# EAGLE schematic ModuleCarrier-RAK811-v1.0.0 (EAGLE 7.7.0)

## Sheet 1 of 2
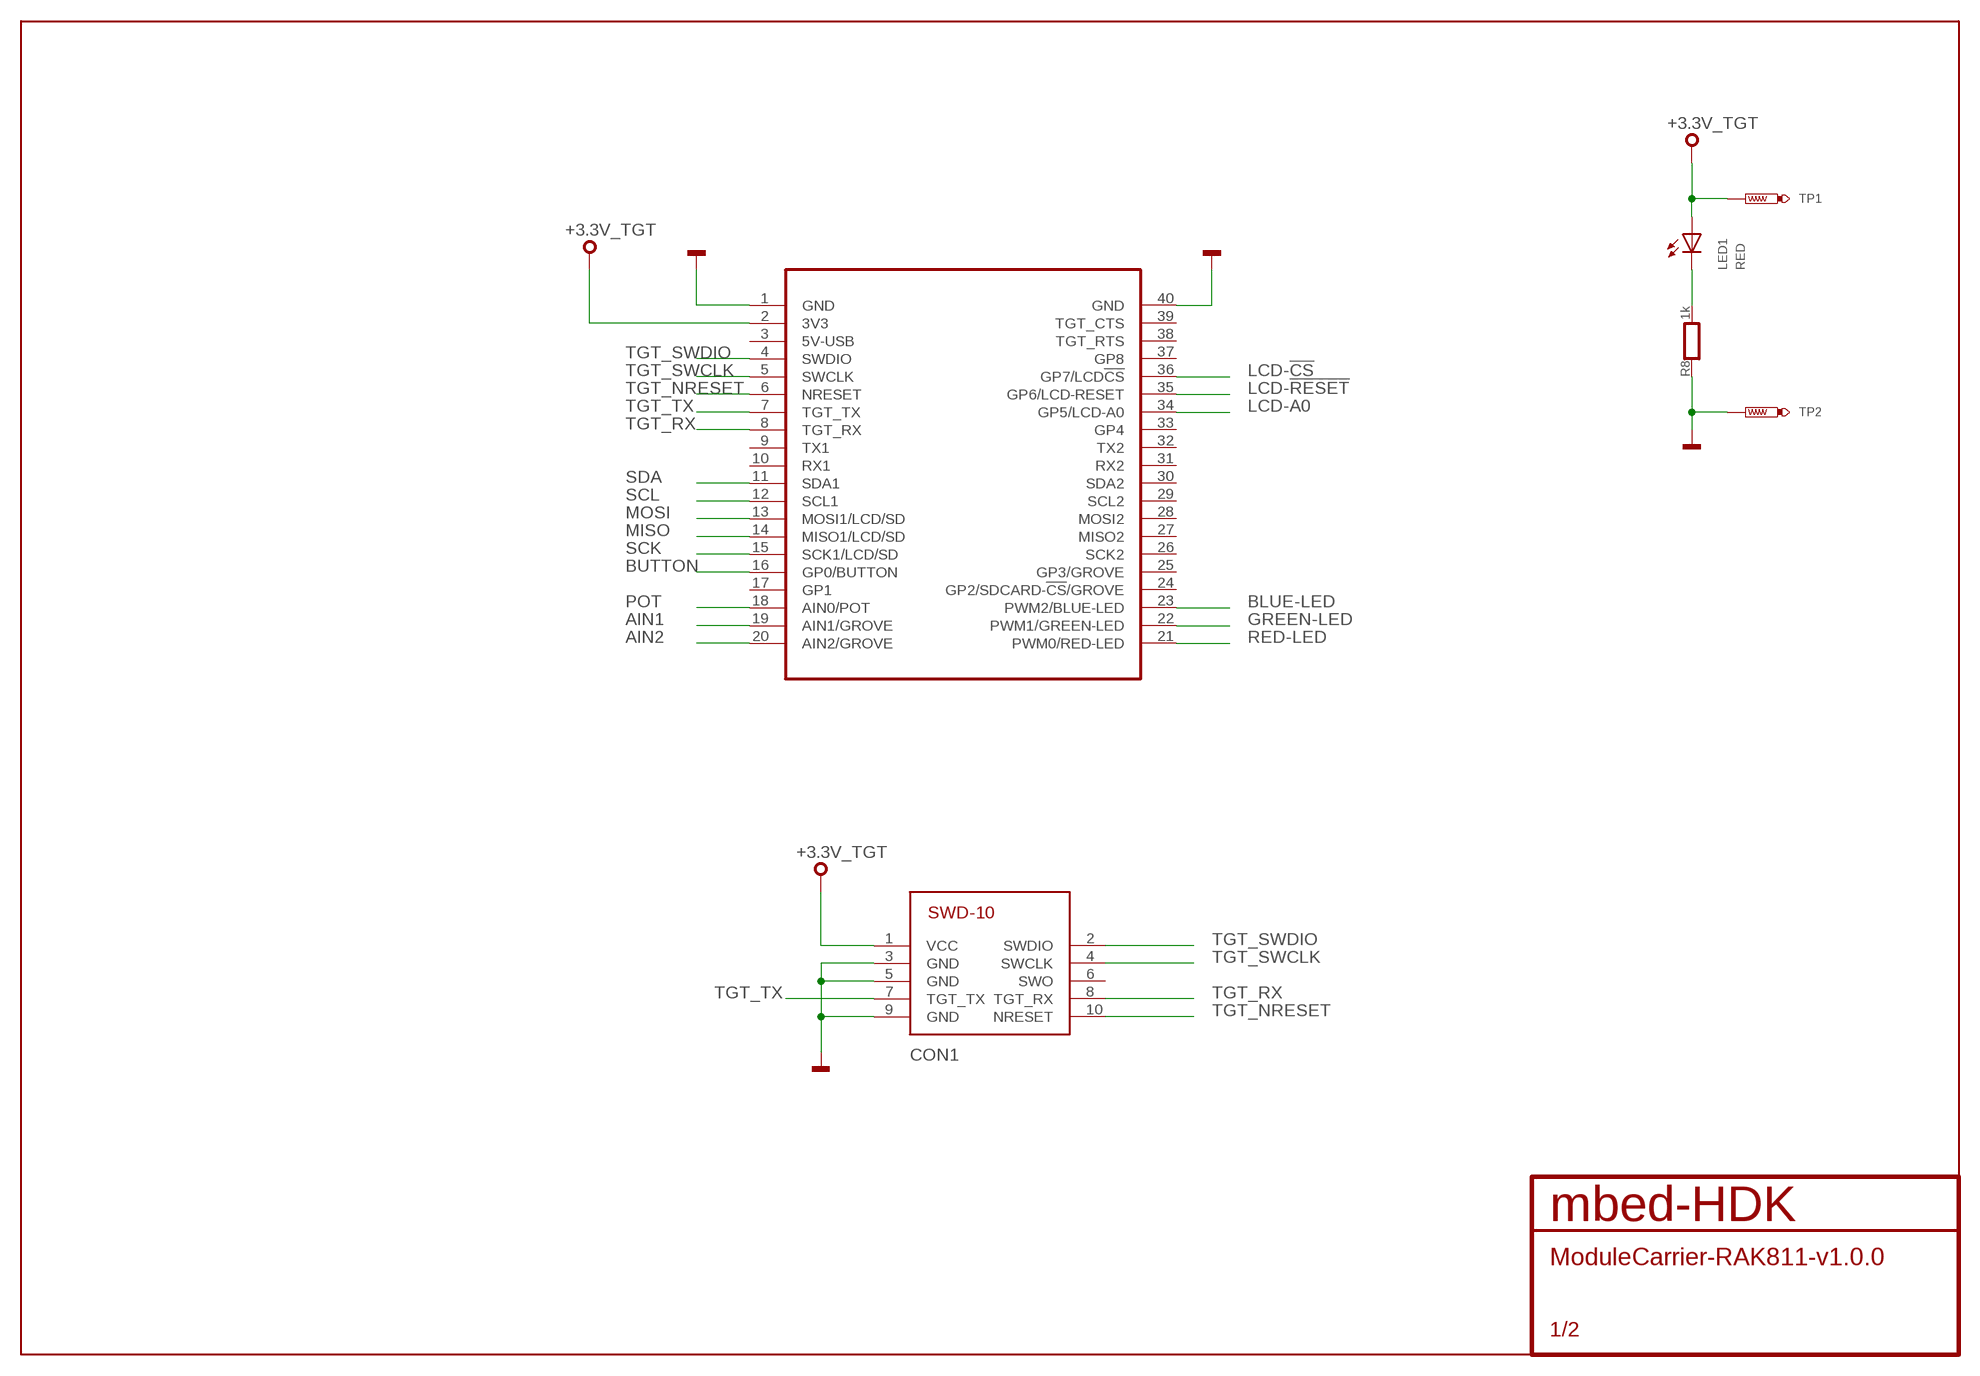
[diagram p0: schematic, sheet 1]

### Parts
CON1  SWD-10/TC2050_SMD  [FTSH-105-02]
LED1  RED  SMD_LED0603  [CHIPLED_0603]
MOD2  MODULE_DAUGHTER  [MODULE_DAUGHTER]
R8  1k  RESISTOR0603  [0603]
TP1  TEST-POINT-50R-PTH  [TP50-PTH]
TP2  TEST-POINT-50R-PTH  [TP50-PTH]

### Nets
+3.3V_TGT: CON1.1(VCC) LED1.A MOD2.2(3V3) TP1.TP ; also sheet 2
AIN1: MOD2.19(AIN1/GROVE) ; also sheet 2
AIN2: MOD2.20(AIN2/GROVE) ; also sheet 2
BLUE-LED: MOD2.23(PWM2/BLUE-LED) ; also sheet 2
BUTTON: MOD2.16(GP0/BUTTON) ; also sheet 2
GND: CON1.3(GND) CON1.5(GND) CON1.9(GND) MOD2.1(GND) MOD2.40(GND) R8.1 TP2.TP ; also sheet 2
GREEN-LED: MOD2.22(PWM1/GREEN-LED) ; also sheet 2
LCD-!CS: MOD2.36(GP7/LCD!CS) ; also sheet 2
LCD-!RESET: MOD2.35(GP6/LCD-RESET) ; also sheet 2
LCD-A0: MOD2.34(GP5/LCD-A0) ; also sheet 2
MISO: MOD2.14(MISO1/LCD/SD) ; also sheet 2
MOSI: MOD2.13(MOSI1/LCD/SD) ; also sheet 2
PA_1: LED1.C R8.2
POT: MOD2.18(AIN0/POT) ; also sheet 2
RED-LED: MOD2.21(PWM0/RED-LED) ; also sheet 2
SCK: MOD2.15(SCK1/LCD/SD) ; also sheet 2
SCL: MOD2.12(SCL1) ; also sheet 2
SDA: MOD2.11(SDA1) ; also sheet 2
TGT_NRESET: CON1.10(NRESET) MOD2.6(NRESET) ; also sheet 2
TGT_RX: CON1.8(TGT_RX) MOD2.8(TGT_RX) ; also sheet 2
TGT_SWCLK: CON1.4(SWCLK) MOD2.5(SWCLK) ; also sheet 2
TGT_SWDIO: CON1.2(SWDIO) MOD2.4(SWDIO) ; also sheet 2
TGT_TX: CON1.7(TGT_TX) MOD2.7(TGT_TX) ; also sheet 2
Unconnected: CON1.6(SWO) MOD2.3(5V-USB) MOD2.9(TX1) MOD2.10(RX1) MOD2.17(GP1) MOD2.24(GP2/SDCARD-!CS!/GROVE) MOD2.25(GP3/GROVE) MOD2.26(SCK2) MOD2.27(MISO2) MOD2.28(MOSI2) MOD2.29(SCL2) MOD2.30(SDA2) MOD2.31(RX2) MOD2.32(TX2) MOD2.33(GP4) MOD2.37(GP8) MOD2.38(TGT_RTS) MOD2.39(TGT_CTS)

## Sheet 2 of 2
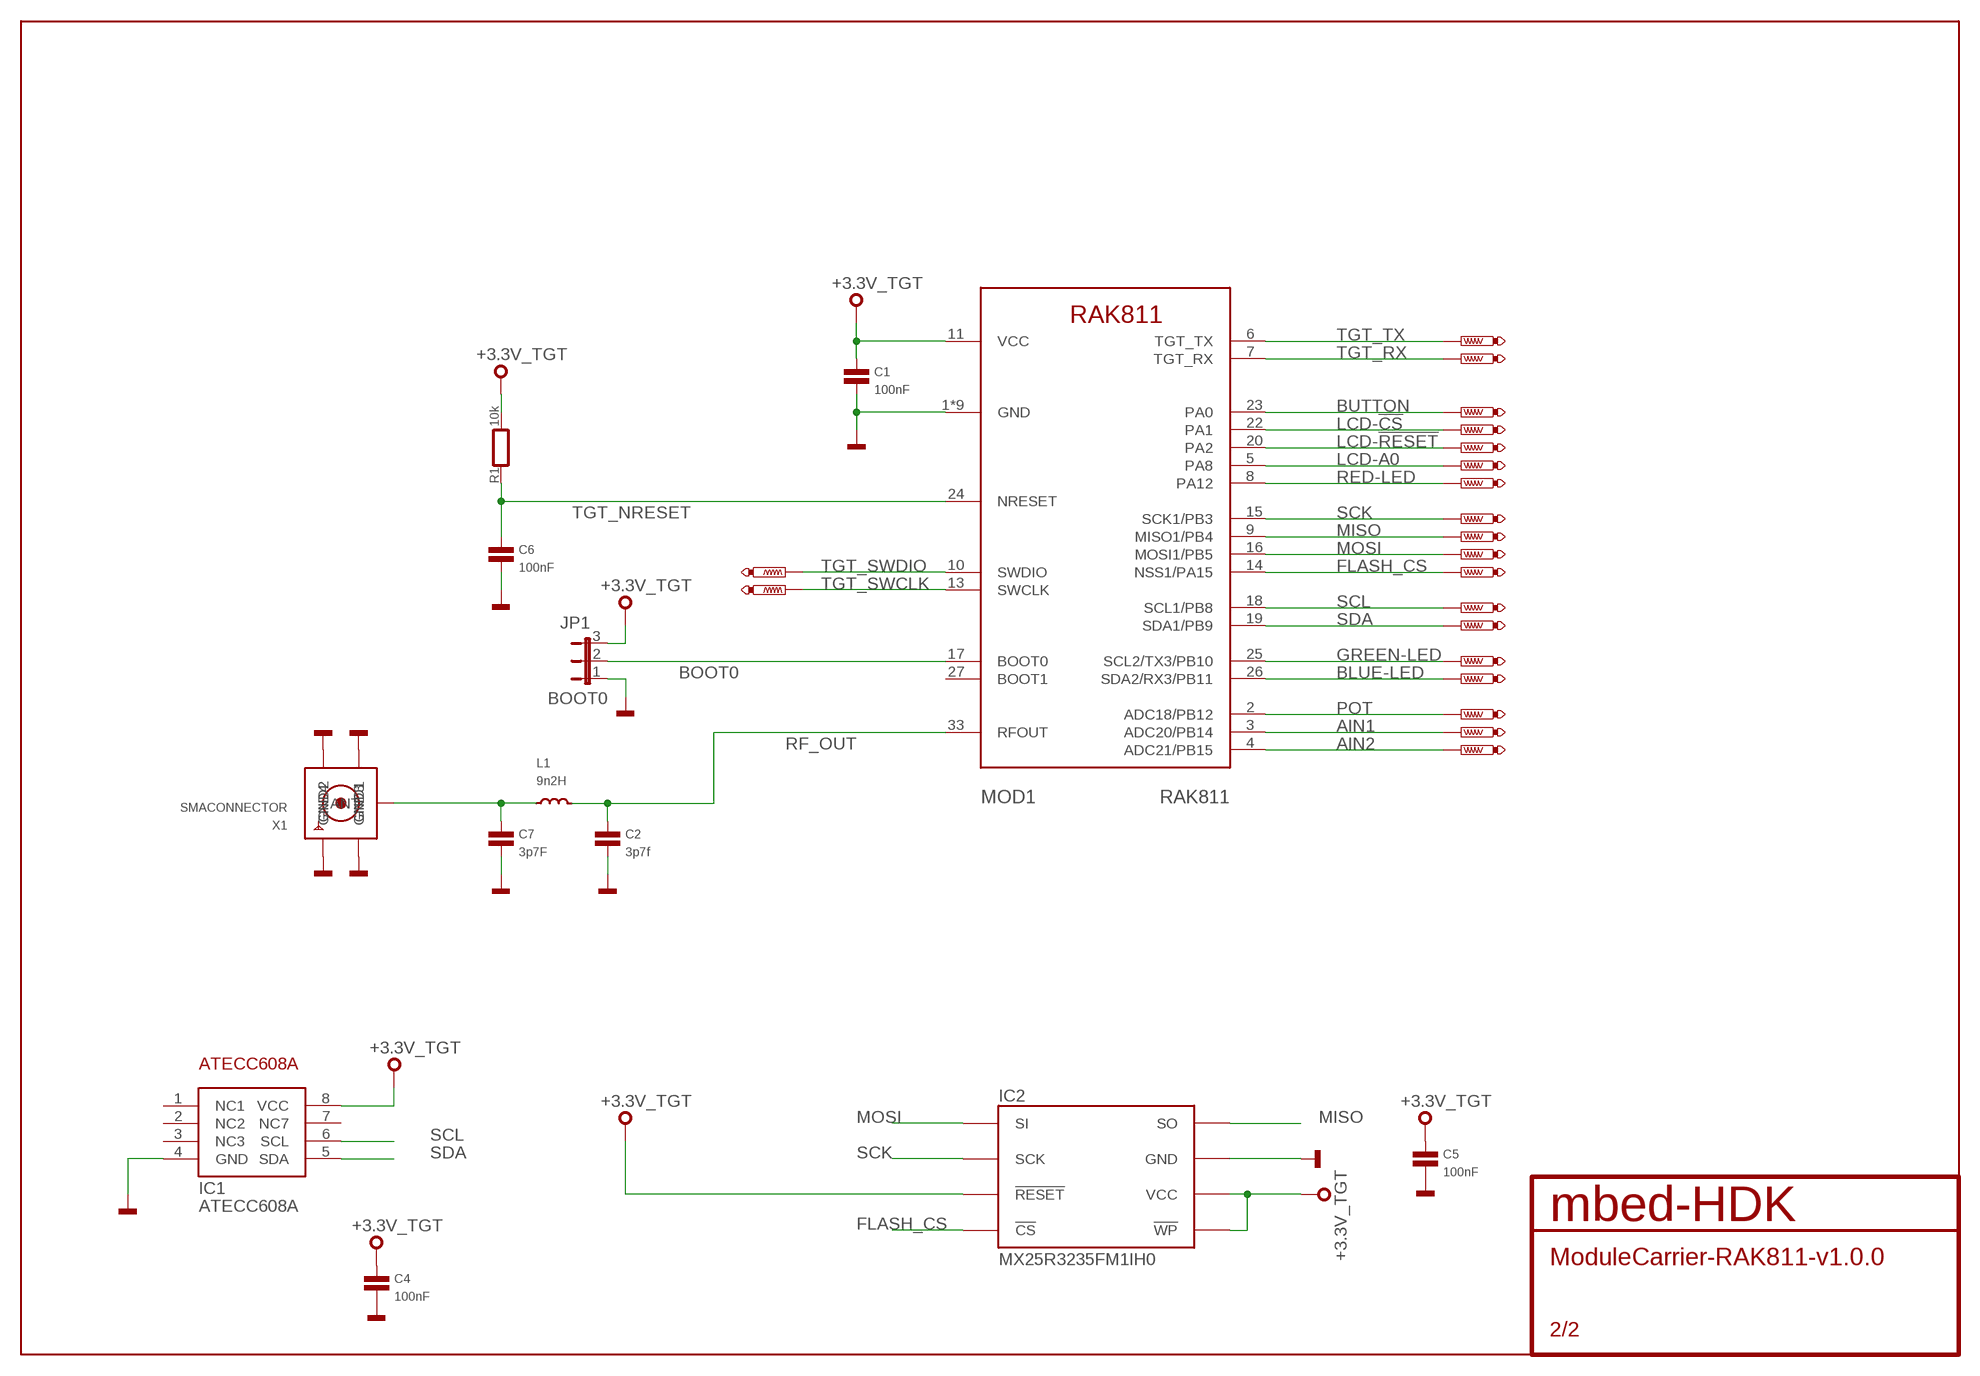
[diagram p1: schematic, sheet 2]

### Parts
C1  100nF  CAPACITOR0603  [0603]
C2  3p7f  CAPACITOR0603  [0603]
C4  100nF  CAPACITOR0603  [0603]
C5  100nF  CAPACITOR0603  [0603]
C6  100nF  CAPACITOR0603  [0603]
C7  3p7F  CAPACITOR0603  [0603]
IC1  ATECC608A  [SO8]
IC2  MX25R3235FM1IH0  [SO8]
JP1  BOOT0  JP2E  [JP2]
L1  9n2H  INDUCTOR0603  [0603]
MOD1  RAK811  [RAK811]
R1  10k  RESISTOR0603  [0603]
TP3  PTR1TP10R  [TP10R]
TP4  PTR1TP10R  [TP10R]
TP5  PTR1TP10R  [TP10R]
TP6  PTR1TP10R  [TP10R]
TP7  PTR1TP10R  [TP10R]
TP8  PTR1TP10R  [TP10R]
TP9  PTR1TP10R  [TP10R]
TP10  PTR1TP10R  [TP10R]
TP11  PTR1TP10R  [TP10R]
TP12  PTR1TP10R  [TP10R]
TP13  PTR1TP10R  [TP10R]
TP14  PTR1TP10R  [TP10R]
TP15  PTR1TP10R  [TP10R]
TP16  PTR1TP10R  [TP10R]
TP17  PTR1TP10R  [TP10R]
TP18  PTR1TP10R  [TP10R]
TP19  PTR1TP10R  [TP10R]
TP20  PTR1TP10R  [TP10R]
TP21  PTR1TP10R  [TP10R]
TP22  PTR1TP10R  [TP10R]
X1  SMACONNECTOR  [SMA90_DIP]

### Nets
+3.3V_TGT: C1.1 C4.1 C5.1 IC1.8(VCC) IC2.3(!WP) IC2.7(!RESET) IC2.8(VCC) JP1.3 MOD1.11(VCC) R1.2 ; also sheet 1
AIN1: MOD1.3(ADC20/PB14) TP13.TP ; also sheet 1
AIN2: MOD1.4(ADC21/PB15) TP12.TP ; also sheet 1
BLUE-LED: MOD1.26(SDA2/RX3/PB11) TP15.TP ; also sheet 1
BOOT0: JP1.2 MOD1.17(BOOT0)
BUTTON: MOD1.23(PA0) TP7.TP ; also sheet 1
FLASH_CS: IC2.1(!CS) MOD1.14(NSS1/PA15) TP19.TP
GND: C1.2 C2.2 C4.2 C5.2 C6.2 C7.2 IC1.4(GND) IC2.4(GND) JP1.1 MOD1.1(GND) MOD1.12(GND) MOD1.21(GND) MOD1.28(GND) MOD1.29(GND) MOD1.30(GND) MOD1.31(GND) MOD1.32(GND) MOD1.34(GND) X1.GND1 X1.GND2 X1.GND3 X1.GND4 ; also sheet 1
GREEN-LED: MOD1.25(SCL2/TX3/PB10) TP16.TP ; also sheet 1
LCD-!CS: MOD1.22(PA1) TP8.TP ; also sheet 1
LCD-!RESET: MOD1.20(PA2) TP9.TP ; also sheet 1
LCD-A0: MOD1.5(PA8) TP10.TP ; also sheet 1
MISO: IC2.2(SO) MOD1.9(MISO1/PB4) TP21.TP ; also sheet 1
MOSI: IC2.5(SI) MOD1.16(MOSI1/PB5) TP20.TP ; also sheet 1
N$9: C7.1 L1.1 X1.ANTENNA(ANT)
POT: MOD1.2(ADC18/PB12) TP14.TP ; also sheet 1
RED-LED: MOD1.8(PA12) TP11.TP ; also sheet 1
RF_OUT: C2.1 L1.2 MOD1.33(RFOUT)
SCK: IC2.6(SCK) MOD1.15(SCK1/PB3) TP22.TP ; also sheet 1
SCL: IC1.6(SCL) MOD1.18(SCL1/PB8) TP18.TP ; also sheet 1
SDA: IC1.5(SDA) MOD1.19(SDA1/PB9) TP17.TP ; also sheet 1
TGT_NRESET: C6.1 MOD1.24(NRESET) R1.1 ; also sheet 1
TGT_RX: MOD1.7(TGT_RX) TP6.TP ; also sheet 1
TGT_SWCLK: MOD1.13(SWCLK) TP4.TP ; also sheet 1
TGT_SWDIO: MOD1.10(SWDIO) TP3.TP ; also sheet 1
TGT_TX: MOD1.6(TGT_TX) TP5.TP ; also sheet 1
Unconnected: IC1.1(NC1) IC1.2(NC2) IC1.3(NC3) IC1.7(NC7) MOD1.27(BOOT1)

## Library data of the parts
C1 C2 C4-C7 = mbed-HDK-RLC:CAPACITOR: Capacitor
CON1 = mbed-HDK-Connector:SWD-10/TC2050: 1mm pitch 10-Pin Cortex Programming Header with optional TC2050 footprint solderless interchangeable
IC1 = blackbriar:ATECC608A
IC2 = blackbriar:MX25R3235FM1IH0: Serial Flash 32 Mb 80 Mhz; MF: Macronix; MFN: MX25R3235FM2IH0; OC-DIGIKEY: 1092-1174-ND
JP1 = blackbriar:JP2E: JUMPER
L1 = mbed-HDK-RLC:INDUCTOR: Inductor
LED1 = mbed-HDK-Optical:SMD_LED: LED SMD, Colour Red; MF: Wurth Electronics Inc; MFN: 150060RS75000; OC-DIGIKEY: 732-4978-1-ND; OC-MOUSER: 710-150060RS75000; OC-NEWARK: 2322071
MOD1 = blackbriar:RAK811
MOD2 = blackbriar:MODULE_DAUGHTER
R1 R8 = mbed-HDK-RLC:RESISTOR: Resistor
TP1 TP2 = mbed-HDK:TEST-POINT
TP3-TP22 = blackbriar:PTR1: TEST PIN
X1 = SMACONNECTOR:SMACONNECTOR: SMA Connector 90° DIP SMA Connector, 50 Ohm (4UConnector: 07259); AVAILABILITY: Good; DESCRIPTION: CONNECTOR, SMA, ANTENNA; SVHC: No SVHC (19-Dec-2012); For Use With: Antenna; Kit Contents: SMA Connector; MF: LPRS; MP: SMA CONNECTOR; PACKAGE: None; PRICE: 1.06 USD